# Altium schematic sheet 1_POWER.schdoc
size 309 x 223 mm; Symbol: Sheet-Symbol_A4; Device: Sheet-Symbol_A4; Company: 嘉立创EDA; Version: V1.0; Page Size: A4; @Project Name: RK3568底板_V1.2; @Page Count: 6; @Update Date: 2024-05-10; @Create Date: 2024-04-18; @Schematic Name: 原理图; @Page No: 2; @Page Name: POWER
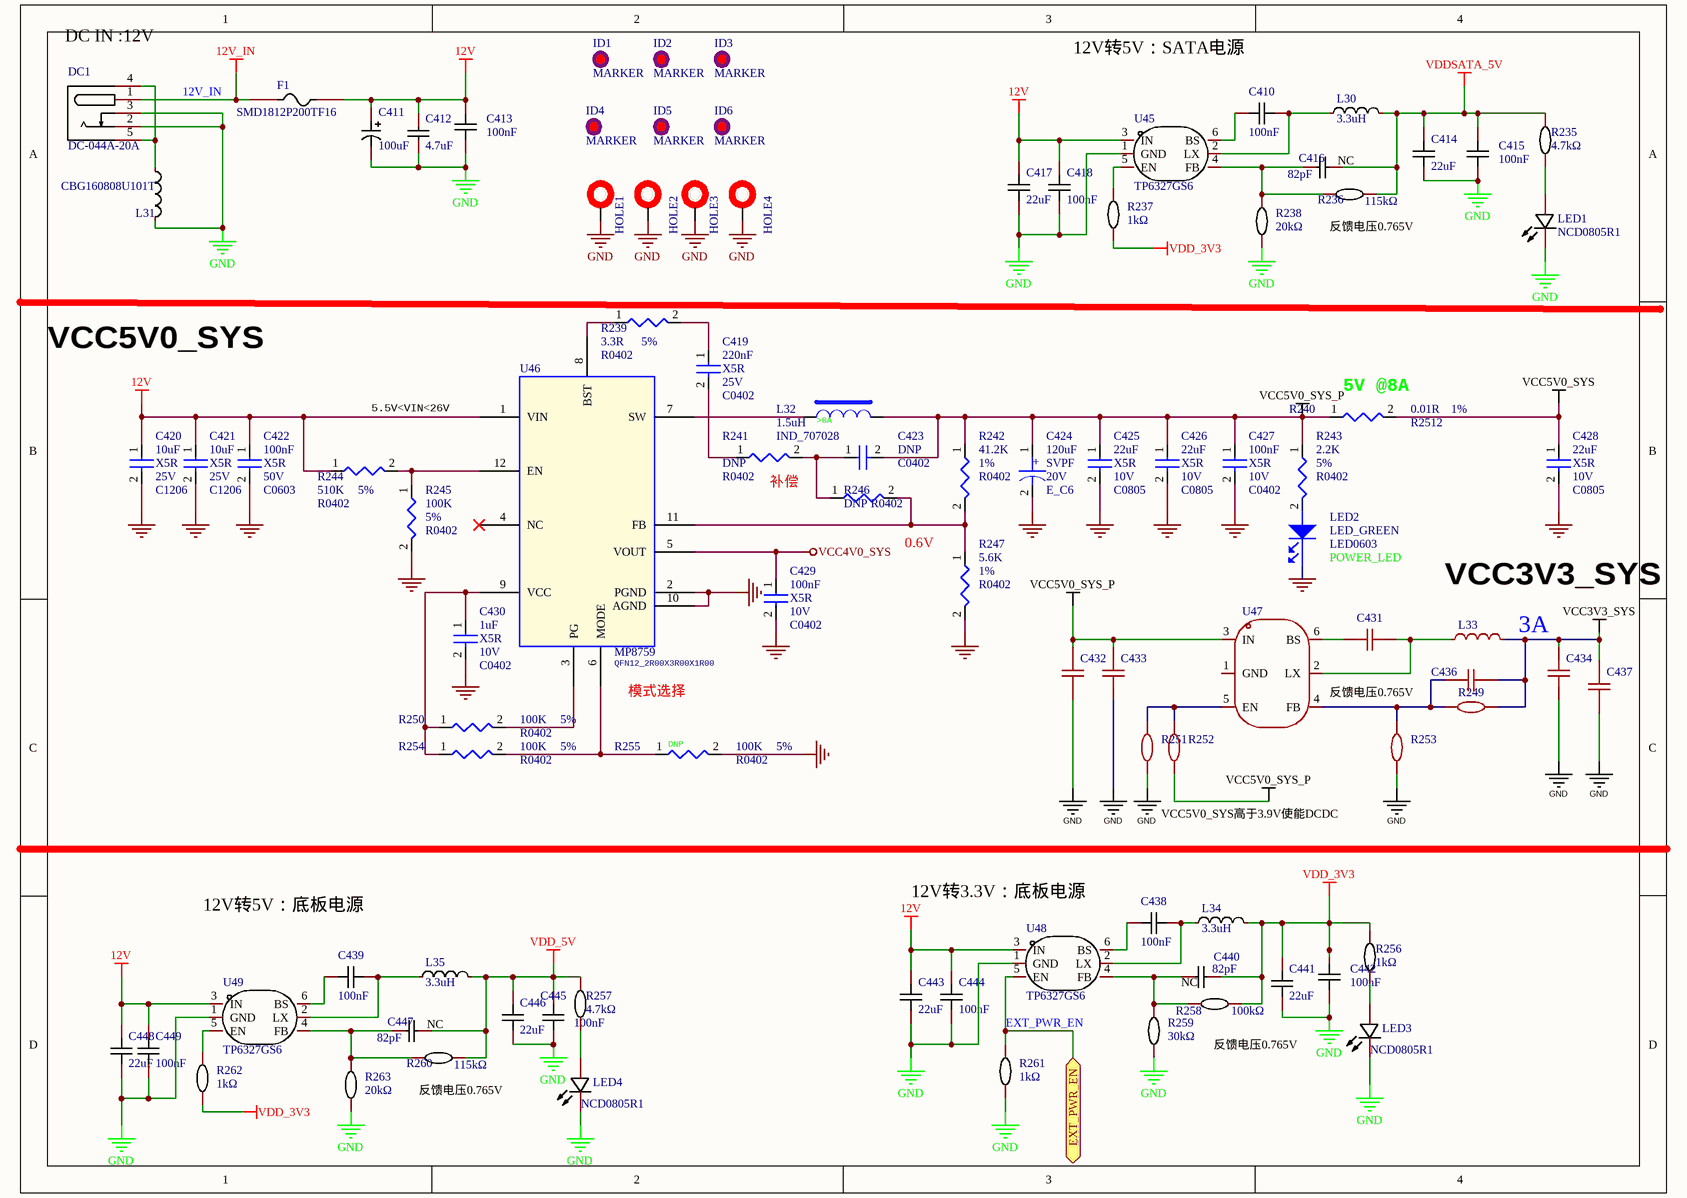
[diagram p0: 1_POWER.schdoc]

## Parts
C410  100nF  [C0603]
C411  100uF  [CAP-SMD_BD6.3-L6.6-W6.6-LS7.3-FD]
C412  4.7uF  [C0603]
C413  100nF  [C0603]
C414  22uF  [C0805]
C415  100nF  [C0603]
C416  82pF  [C0603]
C417  22uF  [C0805]
C418  100nF  [C0603]
C419  220nF  Voltage: 25V  Dielectric: X5R  [C0402]
C420  10uF  Voltage: 25V  Dielectric: X5R  [C1206]
C421  10uF  Voltage: 25V  Dielectric: X5R  [C1206]
C422  100nF  Voltage: 50V  Dielectric: X5R  [C0603]
C423  DNP  [C0402]
C424  120uF  Voltage: 20V  Dielectric: SVPF  [E_C6]
C425  22uF  Voltage: 10V  Dielectric: X5R  [C0805]
C426  22uF  Voltage: 10V  Dielectric: X5R  [C0805]
C427  100nF  Voltage: 10V  Dielectric: X5R  [C0402]
C428  22uF  Voltage: 10V  Dielectric: X5R  [C0805]
C429  100nF  Voltage: 10V  Dielectric: X5R  [C0402]
C430  1uF  Voltage: 10V  Dielectric: X5R  [C0402]
C431  100nF  [C0402]  (value not drawn)
C432  22uF  [C0603]  (value not drawn)
C433  100nF  [C0402]  (value not drawn)
C434  22uF  [C0603]  (value not drawn)
C436  82pF  [C0402]  (value not drawn)
C437  100nF  [C0402]  (value not drawn)
C438  100nF  [C0603]
C439  100nF  [C0603]
C440  82pF  [C0603]
C441  22uF  [C0805]
C442  100nF  [C0603]
C443  22uF  [C0805]
C444  100nF  [C0603]
C445  100nF  [C0603]
C446  22uF  [C0805]
C447  82pF  [C0603]
C448  22uF  [C0805]
C449  100nF  [C0603]
DC1  DC-044A-20A  [DC-IN-TH_DC-044A-20A]
F1  SMD1812P200TF16  [F1812]
HOLE1  HOLE - 不上螺丝  [HOLE-2.2  - SCREW]  (value not drawn)  (no BOM)
HOLE2  HOLE - 不上螺丝  [HOLE-2.2  - SCREW]  (value not drawn)  (no BOM)
HOLE3  HOLE - 不上螺丝  [HOLE-2.2  - SCREW]  (value not drawn)  (no BOM)
HOLE4  HOLE - 不上螺丝  [HOLE-2.2  - SCREW]  (value not drawn)  (no BOM)
ID1  MARKER  [MARKER-C-1.0M]
ID2  MARKER  [MARKER-C-1.0M]
ID3  MARKER  [MARKER-C-1.0M]
ID4  MARKER  [MARKER-C-1.0M]
ID5  MARKER  [MARKER-C-1.0M]
ID6  MARKER  [MARKER-C-1.0M]
L30  3.3uH  [IND-SMD_L4.4-W4.2-A]
L31  CBG160808U101T  [L0603]
L32  1.5uH  Option: >8A  [IND_707028]
L33  3.3uH  [IND-SMD_L4.0-W4.0_FNR40XXS]  (value not drawn)
L34  3.3uH  [IND-SMD_L4.4-W4.2-A]
L35  3.3uH  [IND-SMD_L4.4-W4.2-A]
LED1  NCD0805R1  [LED0805-R-RD]
LED2  LED_GREEN  option: POWER_LED  [LED0603]
LED3  NCD0805R1  [LED0805-R-RD]
LED4  NCD0805R1  [LED0805-R-RD]
R235  4.7kΩ  [R0603]
R236  115kΩ  [R0603]
R237  1kΩ  [R0603]
R238  20kΩ  [R0603]
R239  3.3R  Tolerance: 5%  [R0402]
R240  0.01R  PCB Footprint: R2512  Tolerance: 1%  [R0402]
R241  DNP  [R0402]
R242  41.2K  Tolerance: 1%  [R0402]
R243  2.2K  Tolerance: 5%  [R0402]
R244  510K  Tolerance: 5%  [R0402]
R245  100K  Tolerance: 5%  [R0402]
R246  DNP  [R0402]
R247  5.6K  Tolerance: 1%  [R0402]
R249  100kΩ  [R0402]  (value not drawn)
R250  100K  Tolerance: 5%  [R0402]
R251  10kΩ  [R0402]  (value not drawn)
R252  20kΩ  [R0402]  (value not drawn)
R253  30kΩ  [R0402]  (value not drawn)
R254  100K  Tolerance: 5%  [R0402]
R255  100K  Tolerance: 5%  Option: DNP  [R0402]
R256  1kΩ  [R0603]
R257  4.7kΩ  [R0603]
R258  100kΩ  [R0603]
R259  30kΩ  [R0603]
R260  115kΩ  [R0603]
R261  1kΩ  [R0603]
R262  1kΩ  [R0603]
R263  20kΩ  [R0603]
U45  TP6327GS6  [SOT-23-6_L2.9-W1.6-P0.95-LS2.8-BL]
U46  MP8759  [QFN12_2R00X3R00X1R00]
U47  TP6327GS6  [SOT-23-6_L2.9-W1.6-P0.95-LS2.8-BL]  (value not drawn)
U48  TP6327GS6  [SOT-23-6_L2.9-W1.6-P0.95-LS2.8-BL]
U49  TP6327GS6  [SOT-23-6_L2.9-W1.6-P0.95-LS2.8-BL]

## Ports
EXT_PWR_EN (bidir)

## Nets
12V: C411.1 C412.1 C413.2 C417.2 C418.2 C420.1 C421.1 C422.1 C443.2 C444.2 C448.2 C449.2 F1.2 R244.1 U45.3(IN) U46.1(VIN) U48.3(IN) U49.3(IN)
12V_IN: DC1.1 F1.1
GND: C411.2 C412.2 C413.1 C414.1 C415.1 C417.1 C418.1 C420.2 C421.2 C422.2 C424.2 C425.2 C426.2 C427.2 C428.2 C429.2 C430.2 C432.1 C433.1 C434.1 C437.1 C441.1 C442.1 C443.1 C444.1 C445.1 C446.1 C448.1 C449.1 DC1.2 DC1.3 HOLE1.1 HOLE2.1 HOLE3.1 HOLE4.1 L31.2 LED1.2(-) LED2.2(CATHODE) LED3.2(-) LED4.2(-) R238.1 R245.2 R247.2 R251.1 R253.1 R255.2 R259.1 R261.1 R263.1 U45.1(GND) U46.2(PGND) U46.10(AGND) U48.1(GND) U49.1(GND)
VCC3V3_SYS: C434.2 C436.1 C437.2 L33.2 R249.2
VCC4V0_SYS: C429.1 U46.5(VOUT)
VCC5V0_SYS: C428.1 R240.2
VCC5V0_SYS_P: C423.2 C424.1 C425.1 C426.1 C427.1 C432.2 C433.2 L32.2 R240.1 R242.1 R243.1 R252.1 U47.3(IN)
VDD_3V3: C440.2 C441.2 C442.2 L34.2 R237.1 R256.1 R258.2 R262.1
VDD_5V: C445.2 C446.2 C447.2 L35.2 R257.1 R260.2
VDDSATA_5V: C414.2 C415.2 C416.2 L30.2 R235.1 R236.2
EXT_PWR_EN: R261.2 U48.5(EN) ; port EXT_PWR_EN
NetC410_1: C410.1 U45.6(BS)
NetC410_2: C410.2 L30.1 U45.2(LX)
NetC416_1: C416.1 R236.1 R238.2 U45.4(FB)
NetC419_1: C419.1 R239.2
NetC419_2: C419.2 R241.1
NetC423_1: C423.1 R241.2 R246.1
NetC430_1: C430.1 R250.1 R254.1 U46.9(VCC)
NetC431_1: C431.1 L33.1 U47.2(LX)
NetC431_2: C431.2 U47.6(BS)
NetC436_2: C436.2 R249.1 R253.2 U47.4(FB)
NetC438_1: C438.1 U48.6(BS)
NetC438_2: C438.2 L34.1 U48.2(LX)
NetC439_1: C439.1 U49.6(BS)
NetC439_2: C439.2 L35.1 U49.2(LX)
NetC440_1: C440.1 R258.1 R259.2 U48.4(FB)
NetC447_1: C447.1 R260.1 R263.2 U49.4(FB)
NetDC1_4: DC1.4 DC1.5 L31.1
NetL32_1: L32.1 U46.7(SW)
NetLED1_1: LED1.1(+) R235.2
NetLED2_1: LED2.1(ANODE) R243.2
NetLED3_1: LED3.1(+) R256.2
NetLED4_1: LED4.1(+) R257.2
NetR237_2: R237.2 U45.5(EN)
NetR239_1: R239.1 U46.8(BST)
NetR242_2: R242.2 R246.2 R247.1 U46.11(FB)
NetR244_2: R244.2 R245.1 U46.12(EN)
NetR250_2: R250.2 U46.3(PG)
NetR251_2: R251.2 R252.2 U47.5(EN)
NetR254_2: R254.2 R255.1 U46.6(MODE)
NetR262_2: R262.2 U49.5(EN)

Not connected (* = marked no-connect by the designer): ID1 0; ID2 0; ID3 0; ID4 0; ID5 0; ID6 0; U46 4(NC)*; U47 1(GND)

## Notes on the sheet
- (near DC1) DC IN :12V
- 12V转5V：SATA电源
- (near C416) NC
- (near R236) 反馈电压0.765V
- VCC5V0_SYS
- 5.5V<VIN<26V
- (near R240) 5V @8A
- (near R241) 补偿
- 0.6V
- VCC3V3_SYS
- 3A
- 模式选择
- 反馈电压0.765V
- VCC5V0_SYS高于3.9V使能DCDC
- 12V转5V：底板电源
- (near U48) 12V转3.3V：底板电源
- (near C440) NC
- (near C447) NC
- (near R260) 反馈电压0.765V
- 1
- 2
- 3
- 4
- 5
- 6
- A
- B
- C
- 原理图
- 创建日期
- 更新日期
- 2024-05-10
- 2024-04-18
- 审阅
- 绘制
- 图页
- POWER
- 物料编码
- RK3568底板_V1.2
- D
- 版本
- 尺寸
- 页
- 共
- V1.0
- A4
- 嘉立创EDA
- (in symbol CAP) +

## Library data of the parts
C410 C413 C415 C418 C438 C439 C442 C444 C445 C449 = CC0603KRX7R9BB104: Manufacturer: YAGEO(国巨); Add into BOM: yes; Tolerance: ±10%; Voltage Rated: 50V; Temperature Coefficient: X7R; Name: 100nF; Symbol: CC0603KRX7R9BB104; Device: CC0603KRX7R9BB104; Supplier: LCSC; Manufacturer Part: CC0603KRX7R9BB104; Value: 100nF; Supplier Part: C14663; JLCPCB Part Class: 基础库; LCSC Part Name: 100nF ±10% 50V; Supplier Footprint: 0603; Datasheet: https://atta.szlcsc.com/upload/public/pdf/source/20180910/C282072_33301C7F631E79921B82A8DAC6BCC5B3.pdf; Convert to PCB: yes
C411 = RST100UF25V004: Manufacturer: KNSCHA(科尼盛); Add into BOM: yes; Tolerance: ±20%; Rated Voltage: 25V; Ripple Current: 88mA@120Hz; φD: 6.3mm; L: 5.4mm; Lifetime @ Temp: 2000hrs@105℃; Name: 100uF; Symbol: RST100UF25V004; Device: RST100UF25V004; LCSC Part Name: 100uF ±20% 25V; Supplier Part: C4747964; Manufacturer Part: RST100UF25V004; Supplier Footprint: SMD,D6.3xL5.4mm; JLCPCB Part Class: 扩展库; Datasheet: https://atta.szlcsc.com/upload/public/pdf/source/20220722/52F6C209ACF875FF59C64C72CE2329EE.pdf; Supplier: LCSC; Convert to PCB: yes; Value: 100uF; Equivalent Series Resistance(ESR): -; Operating Temperature: -40℃~+105℃
C412 = CL10A475KA8NQNC: Manufacturer: SAMSUNG(三星); Add into BOM: yes; Tolerance: ±10%; Voltage Rated: 25V; Temperature Coefficient: X5R; Name: 4.7uF; Symbol: CL10A475KA8NQNC; Device: CL10A475KA8NQNC; Supplier: LCSC; Manufacturer Part: CL10A475KA8NQNC; Value: 4.7uF; Supplier Part: C69335; JLCPCB Part Class: 扩展库; LCSC Part Name: 4.7uF ±10% 25V; Supplier Footprint: 0603; Datasheet: https://atta.szlcsc.com/upload/public/pdf/source/20161108/1478586410580.pdf; Convert to PCB: yes
C414 C417 C441 C443 C446 C448 = CL21A226MAQNNNE: Manufacturer: SAMSUNG(三星); Add into BOM: yes; Tolerance: ±20%; Voltage Rated: 25V; Temperature Coefficient: X5R; Name: 22uF; Symbol: CL21A226MAQNNNE; Device: CL21A226MAQNNNE; Supplier: LCSC; Manufacturer Part: CL21A226MAQNNNE; Value: 22uF; Supplier Part: C45783; JLCPCB Part Class: 基础库; LCSC Part Name: 22uF ±20% 25V; Supplier Footprint: 0805; Datasheet: https://atta.szlcsc.com/upload/public/pdf/source/20160218/1457707763339.pdf; Convert to PCB: yes
C416 C440 C447 = CC0603JRNPO9BN820: Manufacturer: YAGEO(国巨); Add into BOM: yes; Tolerance: ±5%; Voltage Rated: 50V; Temperature Coefficient: NP0; Name: 82pF; Symbol: CC0603JRNPO9BN820; Device: CC0603JRNPO9BN820; Supplier: LCSC; Manufacturer Part: CC0603JRNPO9BN820; Value: 82pF; Supplier Part: C107056; JLCPCB Part Class: 扩展库; LCSC Part Name: 82pF ±5% 50V; Supplier Footprint: 0603; Datasheet: https://atta.szlcsc.com/upload/public/pdf/source/20170914/C128857_1505359892143968080.pdf; Convert to PCB: yes
C419 = CAP NP: cap,220.00nF,+/-10%,25V,X5R,C0402; Manufacturer PN: C1005X5R1E224K050BC; Manufacturer: TDK; C_Voltage: 6.3V; Tolerance: 10%; Priority: A; Number: 37; PCB Footprint: C0402; Created by: JJJ; Part Type: C0402; RK PN: C1005X5R1E224K050BC
C420 C421 = CAP NP: cap,10.00uF,+/-10%,25V,X5R,C1206; Manufacturer PN: C3216X5R1E106K085AC; Manufacturer: TDK; Tolerance: 10%; C_Voltage: 6.3V; Priority: A; PCB Footprint: C1206; Created by: JJJ; Part Type: C1206; RK PN: C3216X5R1E106K085AC
C422 = CAP NP: cap,100.00nF,+/-10%,50V,X5R,C0603; Manufacturer PN: C1608X5R1H104K080AA; Manufacturer: TDK; Tolerance: 10%; Priority: A; PCB Footprint: C0603; Created by: JJJ; Part Type: C0603; RK PN: C1608X5R1H104K080AA
C423 = CAP NP: Did Not Place.; Number: 37; RK PN: DNPC0402; Priority: A; C_Voltage: 6.3V; PCB Footprint: C0402; Part Type: DNP; Manufacturer PN: DNPC0402; Created by: JJJ
C424 = CAP: 120uF,20V,25mR,SVPF; Manufacturer PN: 25SVPF100M; Manufacturer: Panasonic; Tolerance: 20%; Priority: A; PCB Footprint: E_C6; Created by: JJJ; Part Type: 贴片固态铝电解; RK PN: 25SVPF100M
C425 = CAP NP: cap,22.00uF,+/-10%,10V,X5R,C0805; Manufacturer: TDK; RK PN: C2012X5R1A226K125AB; Priority: A; C_Voltage: 6.3V; Tolerance: 10%; PCB Footprint: C0805; Part Type: C0805; Manufacturer PN: C2012X5R1A226K125AB; Created by: JJJ
C426 C428 = CAP NP: cap,22.00uF,+/-10%,10V,X5R,C0805; Manufacturer PN: C2012X5R1A226K125AB; Manufacturer: TDK; Tolerance: 10%; C_Voltage: 6.3V; Priority: A; PCB Footprint: C0805; Created by: JJJ; Part Type: C0805; RK PN: C2012X5R1A226K125AB
C427 = CAP NP: cap,100.00nF,+/-10%,10V,X5R,C0402; Manufacturer PN: C1005X5R1A104K050BA; Manufacturer: TDK; C_Voltage: 6.3V; Tolerance: 10%; Priority: A; Number: 37; PCB Footprint: C0402; Created by: JJJ; Part Type: C0402; RK PN: C1005X5R1A104K050BA
C429 = CAP NP: cap,100.00nF,+/-10%,10V,X5R,C0402; Manufacturer: TDK; Number: 37; RK PN: C1005X5R1A104K050BA; Priority: A; Tolerance: 10%; C_Voltage: 6.3V; PCB Footprint: C0402; Part Type: C0402; Manufacturer PN: C1005X5R1A104K050BA; Created by: JJJ
C430 = CAP NP: cap,1.00uF,+/-10%,10V,X5R,C0402; Manufacturer PN: C1005X5R1A105K050BB; Manufacturer: TDK; C_Voltage: 6.3V; Tolerance: 10%; Priority: A; Number: 37; PCB Footprint: C0402; Created by: JJJ; Part Type: C0402; RK PN: C1005X5R1A105K050BB
C431 C433 C437 = CL05B104KB54PNC: 容值:100nF;精度:±10%;额定电压:50V;材质(温度系数):X7R;; Manufacturer: SAMSUNG(三星); Add into BOM: yes; Tolerance: ±10%; Voltage Rated: 50V; Temperature Coefficient: X7R; Symbol: CL05B104KB54PNC; Device: CL05B104KB54PNC; LCSC Part Name: 100nF ±10% 50V; Supplier Part: C307331; Manufacturer Part: CL05B104KB54PNC; Supplier Footprint: 0402; JLCPCB Part Class: 基础库; Datasheet: https://atta.szlcsc.com/upload/public/pdf/source/20160218/1457707763339.pdf; Supplier: LCSC; Convert to PCB: yes; Value: 100nF
C432 C434 = CGA0603X5R226M160JT: 容值:22uF;精度:±20%;额定电压:16V;材质(温度系数):X5R;; Manufacturer: HRE(芯声); Add into BOM: yes; Tolerance: ±20%; Voltage Rated: 16V; Temperature Coefficient: X5R; Symbol: CGA0603X5R226M160JT; Device: CGA0603X5R226M160JT; LCSC Part Name: 22uF ±20% 16V; Supplier Part: C6119868; Manufacturer Part: CGA0603X5R226M160JT; Supplier Footprint: 0603; JLCPCB Part Class: 扩展库; Supplier: LCSC; Convert to PCB: yes; Value: 22uF
C436 = GRM1555C1H820FA01D: 容值:82pF;精度:±1%;额定电压:50V;材质(温度系数):C0G;; Manufacturer: muRata(村田); Add into BOM: yes; Tolerance: ±1%; Voltage Rated: 50V; Temperature Coefficient: C0G; Symbol: GRM1555C1H820FA01D; Device: GRM1555C1H820FA01D; Supplier: LCSC; Supplier Part: C162123; Manufacturer Part: GRM1555C1H820FA01D; Value: 82pF; JLCPCB Part Class: 扩展库; LCSC Part Name: 82pF ±1% 50V; Supplier Footprint: 0402; Datasheet: https://atta.szlcsc.com/upload/public/pdf/source/20200305/C490387_23319AE8C154DEB24C505E6C82A8106A.pdf; Convert to PCB: yes
DC1 = DC-044A-20A: Manufacturer: 韩国韩荣; Add into BOM: yes; Inside Contact Diameter: 2mm; Outside Contact Diameter: 5.9mm; Current Rating (Max): 500mA; Voltage Rating (Max): 30V; Name: DC-044A-20A; Symbol: DC-044A-20A; Device: DC-044A-20A; LCSC Part Name: 内径:2mm 外径:5.9mm; Supplier Part: C129006; Manufacturer Part: DC-044A-20A; Supplier Footprint: 插件; JLCPCB Part Class: 扩展库; Datasheet: https://atta.szlcsc.com/upload/public/pdf/source/20210810/C8974B0AB7FDF70EB0A74D74746E6460.pdf; Supplier: LCSC; Convert to PCB: yes
F1 = SMD1812P200TF16: Manufacturer: RUILON(瑞隆源); Add into BOM: yes; Operating Voltage (Max): 16V; Current Rating (Max): 100A; Hold Current: 2A; Trip Current: 4A; Name: SMD1812P200TF16; Symbol: SMD1812P200TF16; Device: SMD1812P200TF16; Supplier: LCSC; Manufacturer Part: SMD1812P200TF16; Supplier Part: C20812; JLCPCB Part Class: 扩展库; LCSC Part Name: 16V 2A 1812自恢复; Supplier Footprint: 1812; Datasheet: https://atta.szlcsc.com/upload/public/pdf/source/20180904/C117855_6683238635D527B90B087B6C3DDDDA27.pdf; Convert to PCB: yes
L30 L34 L35 = FXL0420-3R3-M: Manufacturer: cjiang(长江微电); Add into BOM: yes; Tolerance: ±20%; Rated Current: 3.3A; Saturation Current (Isat): 4A; DC Resistance (DCR): 87mΩ; Type: 一体成型电感; Name: 3.3uH; Symbol: FXL0420-3R3-M; Device: FXL0420-3R3-M; Supplier: LCSC; Manufacturer Part: FXL0420-3R3-M; Value: 3.3uH; Supplier Part: C167207; JLCPCB Part Class: 扩展库; LCSC Part Name: 3.3uH ±20% 4A; Supplier Footprint: SMD,4.2x4.4mm; Datasheet: https://atta.szlcsc.com/upload/public/pdf/source/20230516/FBADA9890E7FBE97C620F1D8B562D733.pdf; Convert to PCB: yes
L31 = CBG160808U101T: Manufacturer: FH(风华); Add into BOM: yes; Impedance @ Frequency: 100Ω@100MHz; Tolerance: ±25%; DC Resistance: 300mΩ; Current Rating: 200mA; Circuits: 1; Name: CBG160808U101T; Symbol: CBG160808U101T; Device: CBG160808U101T; LCSC Part Name: 单路 0603磁珠 阻抗100Ω@100MHz; Supplier Part: C98498; Manufacturer Part: CBG160808U101T; Supplier Footprint: 0603; JLCPCB Part Class: 扩展库; Datasheet: https://atta.szlcsc.com/upload/public/pdf/source/20190129/C361667_1614D407CC98D1D3CFBD9E1F7511C14D.pdf; Supplier: LCSC; Convert to PCB: yes
L32 = INDUCTORS OF FERRITE_Dup1: Power Inductor,1.5uH,MWSA0603S-1R5MT; Manufacturer: Vishay; Isat: 9.6A; Priority: A; Tolerance: 20%; Irms: 10.5A; PCB Footprint: IND_707028; Part Type: IND; Created by: JJJ
L33 = FNR4030S3R3MT: 电感值:3.3uH;精度:±20%;额定电流:2.6A;饱和电流(Isat):3.6A;; Manufacturer: cjiang(长江微电); Add into BOM: yes; Tolerance: ±20%; Rated Current: 2.6A; Saturation Current (Isat): 3.6A; DC Resistance (DCR): 52mΩ; Symbol: FNR4030S3R3MT; Device: FNR4030S3R3MT; LCSC Part Name: 3.3uH ±20% 3.6A; Supplier Part: C167870; Manufacturer Part: FNR4030S3R3MT; Supplier Footprint: SMD,4x4mm; JLCPCB Part Class: 扩展库; Datasheet: https://atta.szlcsc.com/upload/public/pdf/source/20190327/C167925_9EFF0AABC4CA629C2CC95961DBF7D39D.pdf; Supplier: LCSC; Convert to PCB: yes; Value: 3.3uH
LED1 LED3 LED4 = NCD0805R1: Manufacturer: 国星光电; Symbol: FC-2012HRK-620D; Add into BOM: yes; Emitted Color: 红色; Forward Voltage (VF): 1.6V~2.6V; Power Dissipation: 65mW; Forward Current: 20mA; Dominant Wavelength: 615nm~630nm; Diode Configuration: 独立二极管; Lens Color: 无色透明透镜; Luminous Intensity: 67mcd~195mcd; Viewing Angle: 130°; Name: NCD0805R1; Device: NCD0805R1; Supplier: LCSC; Manufacturer Part: NCD0805R1; Supplier Part: C84256; JLCPCB Part Class: 基础库; LCSC Part Name: NCD0805R1; Supplier Footprint: 0805; Datasheet: https://atta.szlcsc.com/upload/public/pdf/source/20200820/C84256_F0A75A43B3EAD75808600A0514C76B99.pdf; Convert to PCB: yes; Lamp Holder Type: -; Peak Wavelength: -; Color Temperature: -; Mounting Sytle: -; Operating Temperature: -30℃~+85℃
LED2 = LED: 贴片LED灯，0603，绿色; Priority: A; PCB Footprint: LED0603; RK PN: LED_GREEN; Part Type: LED; Created by: JJJ
R235 R257 = 0603WAF4701T5E: Manufacturer: UNI-ROYAL(厚声); Add into BOM: yes; Tolerance: ±1%; Power(Watts): 100mW; Overload Voltage (Max): 75V; Temperature Coefficient: ±100ppm/℃; Name: 4.7kΩ; Symbol: 0603WAF4701T5E; Device: 0603WAF4701T5E; Supplier: LCSC; Manufacturer Part: 0603WAF4701T5E; Supplier Part: C23162; Value: 4.7kΩ; JLCPCB Part Class: 基础库; LCSC Part Name: 4.7kΩ ±1% 100mW 厚膜电阻; Supplier Footprint: 0603; Datasheet: https://atta.szlcsc.com/upload/public/pdf/source/20200306/C422600_1E6D84923E4A46A82E41ADD87F860B5C.pdf; Convert to PCB: yes; Type: 厚膜电阻; Operating Temperature Range: -55℃~+155℃
R236 R260 = 0603WAF1153T5E: Manufacturer: UNI-ROYAL(厚声); Add into BOM: yes; Tolerance: ±1%; Power(Watts): 100mW; Overload Voltage (Max): 75V; Temperature Coefficient: ±100ppm/℃; Name: 115kΩ; Symbol: 0603WAF1153T5E; Device: 0603WAF1153T5E; Supplier: LCSC; Manufacturer Part: 0603WAF1153T5E; Supplier Part: C22783; Value: 115kΩ; JLCPCB Part Class: 扩展库; LCSC Part Name: 115kΩ ±1% 100mW 厚膜电阻; Supplier Footprint: 0603; Datasheet: https://atta.szlcsc.com/upload/public/pdf/source/20200306/C422600_1E6D84923E4A46A82E41ADD87F860B5C.pdf; Convert to PCB: yes; Type: 厚膜电阻; Operating Temperature Range: -55℃~+155℃
R237 R256 R261 R262 = 0603WAF1001T5E: Manufacturer: UNI-ROYAL(厚声); Add into BOM: yes; Tolerance: ±1%; Power(Watts): 100mW; Overload Voltage (Max): 75V; Temperature Coefficient: ±100ppm/℃; Name: 1kΩ; Symbol: 0603WAF1001T5E; Device: 0603WAF1001T5E; Supplier: LCSC; Manufacturer Part: 0603WAF1001T5E; Supplier Part: C21190; Value: 1kΩ; JLCPCB Part Class: 基础库; LCSC Part Name: 1kΩ ±1% 100mW 厚膜电阻; Supplier Footprint: 0603; Datasheet: https://atta.szlcsc.com/upload/public/pdf/source/20200306/C422600_1E6D84923E4A46A82E41ADD87F860B5C.pdf; Convert to PCB: yes; Type: 厚膜电阻; Operating Temperature Range: -55℃~+155℃
R238 R263 = 0603WAF2002T5E: Manufacturer: UNI-ROYAL(厚声); Add into BOM: yes; Tolerance: ±1%; Power(Watts): 100mW; Overload Voltage (Max): 75V; Temperature Coefficient: ±100ppm/℃; Name: 20kΩ; Symbol: 0603WAF2002T5E; Device: 0603WAF2002T5E; Supplier: LCSC; Manufacturer Part: 0603WAF2002T5E; Supplier Part: C4184; Value: 20kΩ; JLCPCB Part Class: 基础库; LCSC Part Name: 20kΩ ±1% 100mW 厚膜电阻; Supplier Footprint: 0603; Datasheet: https://atta.szlcsc.com/upload/public/pdf/source/20200306/C422600_1E6D84923E4A46A82E41ADD87F860B5C.pdf; Convert to PCB: yes; Type: 厚膜电阻; Operating Temperature Range: -55℃~+155℃
R239 = RESISTOR_Dup1: 通用厚膜电阻,3R3,+/-5%,R0402,1/16W.; Manufacturer: YAGEO; RK PN: RC0402JR-073R3L; Priority: A; Wattage: 1/16W; PCB Footprint: R0402; Part Type: 通用厚膜电阻; Manufacturer PN: RC0402JR-073R3L; Created by: YTL
R240 = RESISTOR_Dup1: 厚膜低阻值电阻,0R01,+/-1%,R2512,1W.; Manufacturer: YAGEO; RK PN: RL2512FK-070R012L; Priority: A; Wattage: 1W; Part Type: 厚膜低阻值电阻; Manufacturer PN: RL2512FK-070R012L; Created by: YTL
R241 = RESISTOR_Dup1: Did Not Place.; RK PN: DNPR0402; Priority: A; PCB Footprint: R0402; Part Type: DNP; Manufacturer PN: DNPR0402; Created by: JJJ
R242 = RESISTOR_Dup1: 通用厚膜电阻,43K,+/-1%,R0402,1/16W.; Manufacturer PN: RC0402FR-0743KL; Manufacturer: YAGEO; Wattage: 1/16W; Priority: A; PCB Footprint: R0402; Created by: YTL; Part Type: 通用厚膜电阻; RK PN: RC0402FR-0743KL
R243 = RESISTOR_Dup1: 通用厚膜电阻,2K2,+/-5%,R0402,1/16W.; Manufacturer: YAGEO; RK PN: RC0402JR-072K2L; Priority: A; Wattage: 1/16W; PCB Footprint: R0402; Part Type: 通用厚膜电阻; Manufacturer PN: RC0402JR-072K2L; Created by: YTL
R244 = RESISTOR_Dup1: 通用厚膜电阻,510K,+/-5%,R0402,1/16W.; Manufacturer PN: RC0402JR-07510KL; Manufacturer: YAGEO; Wattage: 1/16W; Priority: A; PCB Footprint: R0402; Created by: YTL; Part Type: 通用厚膜电阻; RK PN: RC0402JR-07510KL
R245 R254 R255 = RESISTOR_Dup1: 通用厚膜电阻,100K,+/-5%,R0402,1/16W.; Manufacturer PN: RC0402JR-07100KL; Manufacturer: YAGEO; Wattage: 1/16W; Priority: A; PCB Footprint: R0402; Created by: YTL; Part Type: 通用厚膜电阻; RK PN: RC0402JR-07100KL
R246 = RESISTOR_Dup1: Did Not Place.; Manufacturer PN: DNPR0402; Priority: A; PCB Footprint: R0402; Created by: JJJ; Part Type: DNP; RK PN: DNPR0402
R247 = RESISTOR_Dup1: 通用厚膜电阻,7K5,+/-1%,R0402,1/16W.; Manufacturer PN: RC0402FR-077K5L; Manufacturer: YAGEO; Wattage: 1/16W; Priority: A; PCB Footprint: R0402; Created by: YTL; Part Type: 通用厚膜电阻; RK PN: RC0402FR-077K5L
R249 = 0402WGF1003TCE: 电阻类型:厚膜电阻;阻值:100kΩ;精度:±1%;功率:62.5mW;最大工作电压:50V;温度系数:±100ppm/℃;; Manufacturer: UNI-ROYAL(厚声); Add into BOM: yes; Tolerance: ±1%; Power(Watts): 62.5mW; Overload Voltage (Max): 50V; Symbol: 0402WGF1003TCE; Device: 0402WGF1003TCE; Supplier: LCSC; Manufacturer Part: 0402WGF1003TCE; Supplier Part: C25741; Value: 100kΩ; JLCPCB Part Class: 基础库; LCSC Part Name: 100kΩ ±1% 62.5mW 厚膜电阻; Supplier Footprint: 0402; Datasheet: https://atta.szlcsc.com/upload/public/pdf/source/20200306/C422600_1E6D84923E4A46A82E41ADD87F860B5C.pdf; Convert to PCB: yes; Type: 厚膜电阻; Temperature Coefficient: ±100ppm/℃; Operating Temperature Range: -55℃~+155℃
R250 = RESISTOR_Dup1: 通用厚膜电阻,100K,+/-5%,R0402,1/16W.; Manufacturer: YAGEO; RK PN: RC0402JR-07100KL; Priority: A; Wattage: 1/16W; PCB Footprint: R0402; Part Type: 通用厚膜电阻; Manufacturer PN: RC0402JR-07100KL; Created by: YTL
R251 = 0402WGF1002TCE: 电阻类型:厚膜电阻;阻值:10kΩ;精度:±1%;功率:62.5mW;最大工作电压:50V;温度系数:±100ppm/℃;; Manufacturer: UNI-ROYAL(厚声); Add into BOM: yes; Tolerance: ±1%; Power(Watts): 62.5mW; Overload Voltage (Max): 50V; Symbol: 0402WGF1002TCE; Device: 0402WGF1002TCE; LCSC Part Name: 10kΩ ±1% 62.5mW 厚膜电阻; Supplier Part: C25744; Manufacturer Part: 0402WGF1002TCE; Supplier Footprint: 0402; JLCPCB Part Class: 基础库; Datasheet: https://atta.szlcsc.com/upload/public/pdf/source/20200306/C422600_1E6D84923E4A46A82E41ADD87F860B5C.pdf; Supplier: LCSC; Convert to PCB: yes; Type: 厚膜电阻; Value: 10kΩ; Temperature Coefficient: ±100ppm/℃; Operating Temperature Range: -55℃~+155℃
R252 = 0402WGF2002TCE: 电阻类型:厚膜电阻;阻值:20kΩ;精度:±1%;功率:62.5mW;最大工作电压:50V;温度系数:±100ppm/℃;; Manufacturer: UNI-ROYAL(厚声); Add into BOM: yes; Tolerance: ±1%; Power(Watts): 62.5mW; Overload Voltage (Max): 50V; Symbol: 0402WGF2002TCE; Device: 0402WGF2002TCE; Supplier: LCSC; Manufacturer Part: 0402WGF2002TCE; Supplier Part: C25765; Value: 20kΩ; JLCPCB Part Class: 基础库; LCSC Part Name: 20kΩ ±1% 62.5mW 厚膜电阻; Supplier Footprint: 0402; Datasheet: https://atta.szlcsc.com/upload/public/pdf/source/20200306/C422600_1E6D84923E4A46A82E41ADD87F860B5C.pdf; Convert to PCB: yes; Type: 厚膜电阻; Temperature Coefficient: ±100ppm/℃; Operating Temperature Range: -55℃~+155℃
R253 = 0402WGF3002TCE: 电阻类型:厚膜电阻;阻值:30kΩ;精度:±1%;功率:62.5mW;最大工作电压:50V;温度系数:±100ppm/℃;; Manufacturer: UNI-ROYAL(厚声); Add into BOM: yes; Tolerance: ±1%; Power(Watts): 62.5mW; Overload Voltage (Max): 50V; Symbol: 0402WGF3002TCE; Device: 0402WGF3002TCE; Supplier: LCSC; Manufacturer Part: 0402WGF3002TCE; Supplier Part: C25776; Value: 30kΩ; JLCPCB Part Class: 扩展库; LCSC Part Name: 30kΩ ±1% 62.5mW 厚膜电阻; Supplier Footprint: 0402; Datasheet: https://atta.szlcsc.com/upload/public/pdf/source/20200306/C422600_1E6D84923E4A46A82E41ADD87F860B5C.pdf; Convert to PCB: yes; Type: 厚膜电阻; Temperature Coefficient: ±100ppm/℃; Operating Temperature Range: -55℃~+155℃
R258 = RC0603FR-07100KL: Manufacturer: YAGEO(国巨); Add into BOM: yes; Tolerance: ±1%; Power(Watts): 100mW; Overload Voltage (Max): 75V; Temperature Coefficient: ±100ppm/℃; Name: 100kΩ; Symbol: RC0603FR-07100KL; Device: RC0603FR-07100KL; Supplier: LCSC; Supplier Part: C14675; Manufacturer Part: RC0603FR-07100KL; Value: 100kΩ; JLCPCB Part Class: 扩展库; LCSC Part Name: 厚膜电阻 100kΩ ±1% 100mW; Supplier Footprint: 0603; Datasheet: https://atta.szlcsc.com/upload/public/pdf/source/20140324/1457707028752.pdf; Convert to PCB: yes; Type: 厚膜电阻; Operating Temperature Range: -55℃~+155℃
R259 = 0603WAF3002T5E: Manufacturer: UNI-ROYAL(厚声); Add into BOM: yes; Tolerance: ±1%; Power(Watts): 100mW; Overload Voltage (Max): 75V; Temperature Coefficient: ±100ppm/℃; Name: 30kΩ; Symbol: 0603WAF3002T5E; Device: 0603WAF3002T5E; Supplier: LCSC; Manufacturer Part: 0603WAF3002T5E; Supplier Part: C22984; Value: 30kΩ; JLCPCB Part Class: 基础库; LCSC Part Name: 30kΩ ±1% 100mW 厚膜电阻; Supplier Footprint: 0603; Datasheet: https://atta.szlcsc.com/upload/public/pdf/source/20200306/C422600_1E6D84923E4A46A82E41ADD87F860B5C.pdf; Convert to PCB: yes; Type: 厚膜电阻; Operating Temperature Range: -55℃~+155℃
U45 U47-U49 = TP6327GS6: Manufacturer: TECH PUBLIC(台舟); Add into BOM: yes; Symbol: TP6327GS6; Device: TP6327GS6; LCSC Part Name: TP6327GS6; Supplier Part: C2844925; Manufacturer Part: TP6327GS6; Supplier Footprint: SOT-23-6; JLCPCB Part Class: 扩展库; Datasheet: https://atta.szlcsc.com/upload/public/pdf/source/20210810/090DC3867F1E870FCCF437E7AD17BAB4.pdf; Supplier: LCSC; Convert to PCB: yes
  U45 U48 U49: Name: TP6327GS6
U46 = MP8759_6: PCB Footprint: QFN12_2R00X3R00X1R00